# Altium schematic sheet USB.SchDoc
size A4; SheetNumber: 2; SheetTotal: 8
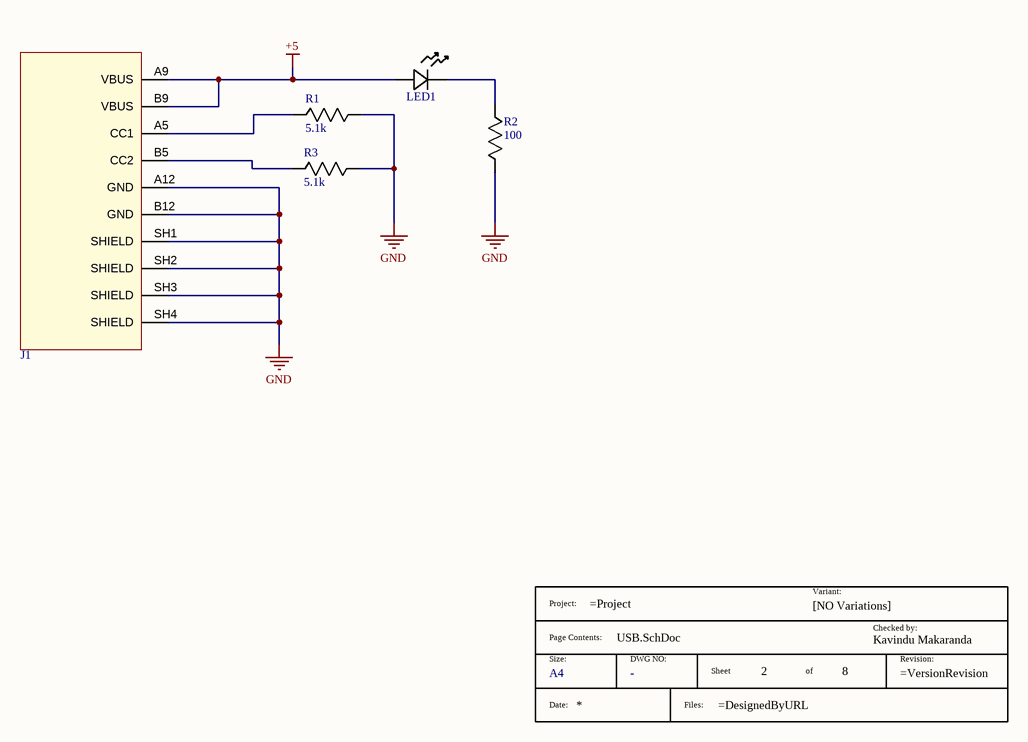
[diagram p0: USB.SchDoc]

## Parts
*?  Size: A4  (hidden comment: TitleBlock)  (graphical)
J1  USB_Type_C  [AMPHENOL_10174819-00011LF]  (value not drawn)
LED1  LED GREEN DIFFUSED 0603 SMD  [LED_B1931NG_HVK]  (value not drawn)
R1  5.1k  [RESC1608X55N]
R2  100  [RESC1608X55N]
R3  5.1k  [RESC1608X55N]

## Nets
+5: J1.A9(VBUS) J1.B9(VBUS) LED1.2(ANODE)
GND: J1.A12(GND) J1.B12(GND) J1.SH1(SHIELD) J1.SH2(SHIELD) J1.SH3(SHIELD) J1.SH4(SHIELD) R1.2 R2.1 R3.2
NetJ1_A5: J1.A5(CC1) R1.1
NetJ1_B5: J1.B5(CC2) R3.1
NetLED1_1: LED1.1(CATHODE) R2.2

## Notes on the sheet
- THIS DOCUMENT AND THE DATA DISCLOSED HEREIN OR
- HEREWITH IS THE PROPERTY OF ALTIUM LIMITED AND MAY
- DWG NO:
- REVISION
- REV:
- DESCRIPTION
- DATE
- APPROVED
- BE FREELY DISTRIBUTED IN WHOLE. NO RIGHTS ARE
- RESERVED OR EXPRESS OR IMPLIED WARANTEE GIVEN.
- ENG:
- APPROVALS
- PROJECT
- DSN:
- CHK:
- REFERENCE DOCUMENTS
- PROJECT REVISION:
- TITLE
- DOCUMENT REVISION:
- DESIGN ITEM:
- BOM:
- FAB DWG:
- PCB DWG:
- ASSY DWG:
- SCALE:
- A3
- SIZE
- CAGE CODE
- FILE NAME
- DWG NO.
- SHEET
- OF
- REV
- (in symbol TitleBlock) Project:; Variant:; [NO Variations]; Checked by:; Page Contents:; Kavindu Makaranda; Size:; DWG NO:; Sheet; of; Revision:; Date:; Files:

## Library data of the parts
*? = TitleBlock: Standard Title Block; DWG NO: -
J1 = 10174819-00011LF: USB-C (USB TYPE-C) Receptacle Connector 24 (6+18 Dummy) Position Surface Mount, Right Angle; MF: Amphenol Communications Solutions-FCI; SnapEDA_Link: https://www.snapeda.com/parts/10174819-00011LF/Amphenol/view-part/?ref=snap; Package: None; Value: *; MP: 10174819-00011LF; Check_prices: https://www.snapeda.com/parts/10174819-00011LF/Amphenol/view-part/?ref=eda; Supplier 1: Digikey; Supplier Part Number 1: 609-10174819-00011LFCT-ND
LED1 = B1931NG--20D001114U1930: Mfr_Name: Harvatek; Type: LED Indication; Supplier 1: Digikey; Supplier Part Number 1: 3147-B1931NG--20D001114U1930CT-ND
R1 R3 = RC0603FR-075K1L: Resistor RC0603FR-075K1L; Manufacturer_Name: KEMET; Datasheet Link: http://www.yageo.com/documents/recent/PYu-RC0603_51_RoHS_L_v5.pdf; Height: 0.55mm; Manufacturer_Part_Number: RC0603FR-075K1L; Mouser Part Number: 603-RC0603FR-075K1L; Mouser Price/Stock: https://www.mouser.co.uk/ProductDetail/YAGEO/RC0603FR-075K1L?qs=gt6vzsuosg2jUUwxnI2PJQ%3D%3D; Arrow Part Number: RC0603FR-075K1L; Arrow Price/Stock: https://www.arrow.com/en/products/rc0603fr-075k1l/yageo?region=nac; Supplier 1: Digikey; Supplier Part Number 1: 311-5.10KHRCT-ND
R2 = ERJ-3EKF1000V: Resistor ERJ-3EKF1000V; Manufacturer_Name: Panasonic; Datasheet Link: http://industrial.panasonic.com/cdbs/www-data/pdf/RDA0000/AOA0000C86.pdf; Height: 0.55mm; Manufacturer_Part_Number: ERJ-3EKF1000V; Mouser Part Number: 667-ERJ-3EKF1000V; Mouser Price/Stock: https://www.mouser.co.uk/ProductDetail/Panasonic/ERJ-3EKF1000V?qs=H7k1u0Mp9JS7i8KGO5m47A%3D%3D; Arrow Part Number: ERJ-3EKF1000V; Arrow Price/Stock: https://www.arrow.com/en/products/erj-3ekf1000v/panasonic?utm_currency=USD&region=nac; Supplier 1: Mouser; Supplier Part Number 1: 667-ERJ-3EKF1000V